# EAGLE design EquaBoardDB (EAGLE 6.5.0)
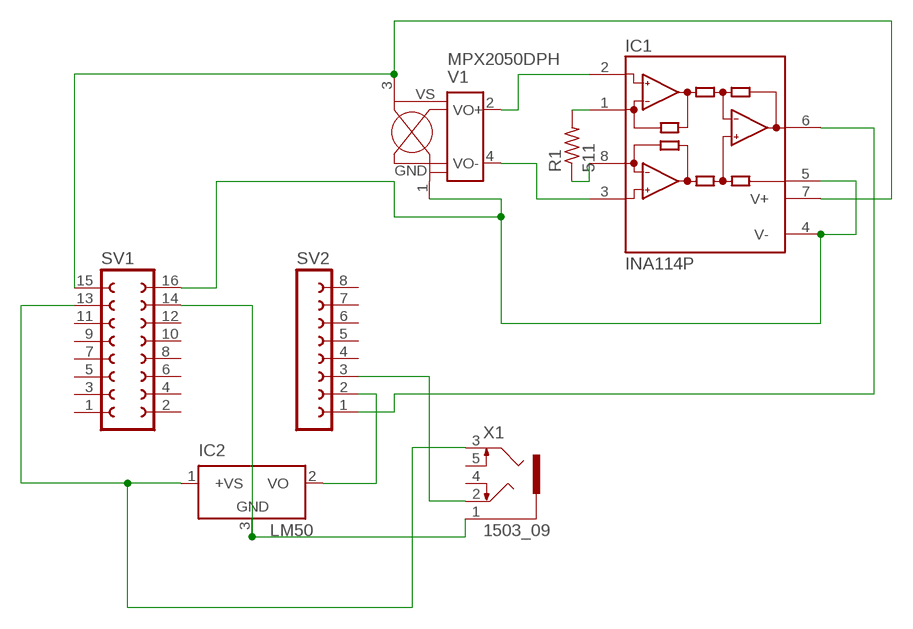
[diagram p0: schematic, sheet 1]

## Parts
IC1  INA114P  [DIL08]
IC2  LM50  [SOT23]
R1  511  R-US_0204/7  [0204/7]
SV1  FE08-2  [FE08-2]
SV2  FE08-1  [FE08]
V1  MPX2050DPH  [MPX2050DPH]
X1  1503_09  [1503_09]

## Nets
N$1: IC1.2(-IN) V1.2(VO+)
N$2: IC1.3(+IN) V1.4(VO-)
N$3: IC1.1(RG) R1.2
N$4: IC1.8(RG) R1.1
N$5: IC1.4(V-) IC1.5(REF) SV1.16 V1.1(GND)
N$6: IC1.7(V+) SV1.15 V1.3(VS)
N$8: IC1.6(OUT) SV2.1
N$9: IC2.1(+VS) SV1.13 X1.3
N$10: IC2.3(GND) SV1.14 X1.1
N$11: IC2.2(VO) SV2.2
N$13: SV2.3 X1.2
Unconnected: SV1.1 SV1.2 SV1.3 SV1.4 SV1.5 SV1.6 SV1.7 SV1.8 SV1.9 SV1.10 SV1.11 SV1.12 SV2.4 SV2.5 SV2.6 SV2.7 SV2.8 X1.4 X1.5

## Library data of the parts
IC1 = burr-brown:INA114: Precision Instrumentation Amplifier; MF: TEXAS INSTRUMENTS; MPN: INA114BP; OC_FARNELL: 1212399; OC_NEWARK: 74K3810
IC2 = linear:LM50: SOT-23 Single-Supply Centigrade Temperature Sensor Vout = (10mV/°C x Temp °C) +5mmmV Source: http://cache.national.com/ds/LM/LM50.pdf
R1 = rcl:R-US_: RESISTOR, American symbol
SV1 = con-lsta:FE08-2: FEMALE HEADER; OC_FARNELL: unknown; OC_NEWARK: unknown
SV2 = con-lsta:FE08-1: FEMALE HEADER; OC_FARNELL: unknown; OC_NEWARK: unknown
V1 = motorola-sensor-driver:MPX2050*: 50 kPa Pressure Sensor On-Chip Temparetur Compensated & Calibrated Silicon Pressure Sensor; OC_FARNELL: unknown; OC_NEWARK: unknown
X1 = con-lumberg:1503_09: Jack connectors according to JISC 6560, 3.5 mm Klinkeneinbaukupplung nach JISC 6560, 3,5 mm, 3-polig/ stereo, abgewinkelte Ausführung, mit 2 Öffnern und Lötaugen, für Leiterplatten Rückseitenmontage Source: http://www.lumberg.com/Produkte/PDFs/1503_09.pdf; OC_FARNELL: 1243244; OC_NEWARK: unknown

## Board
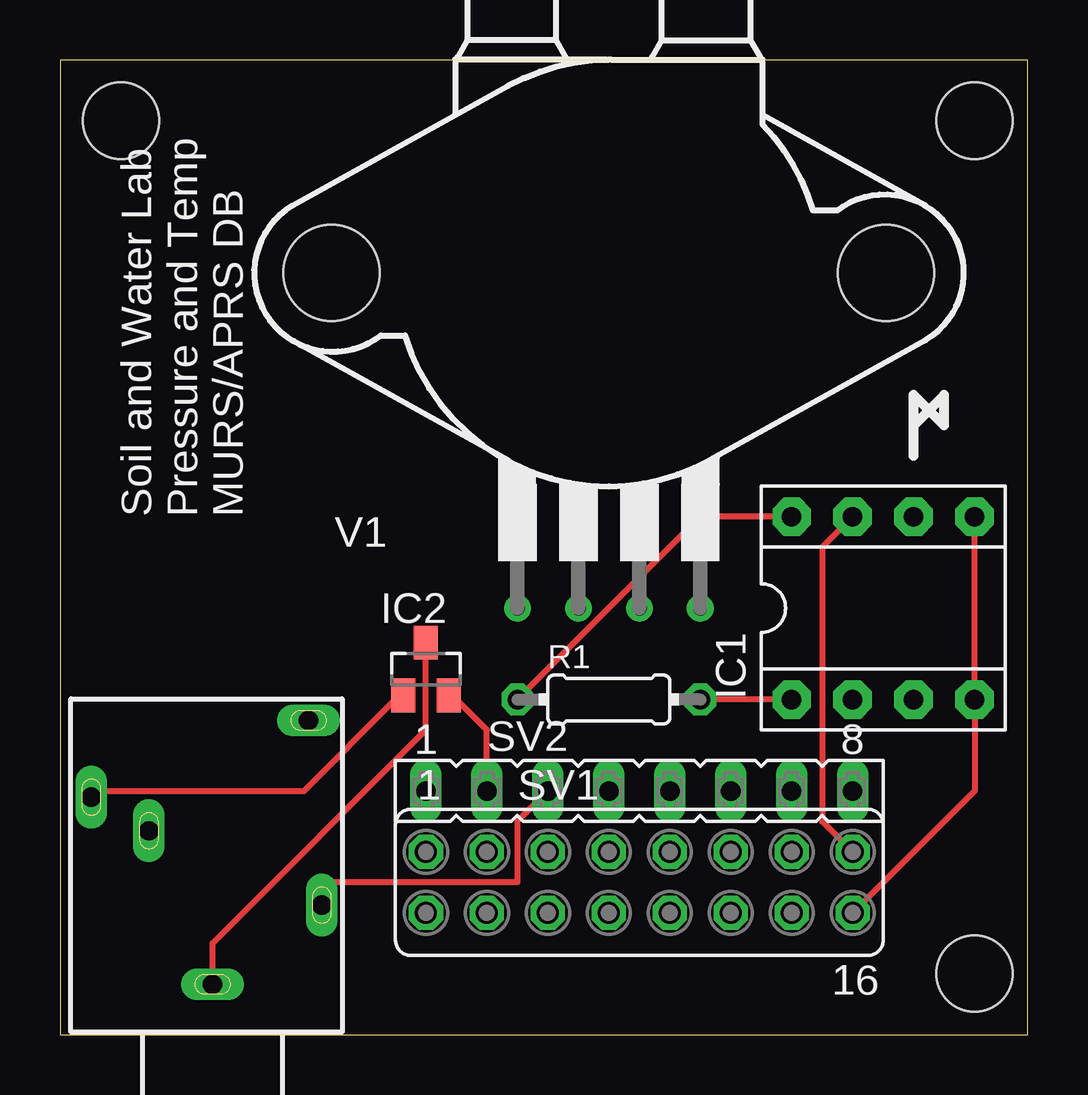
[diagram p1: board, top side]
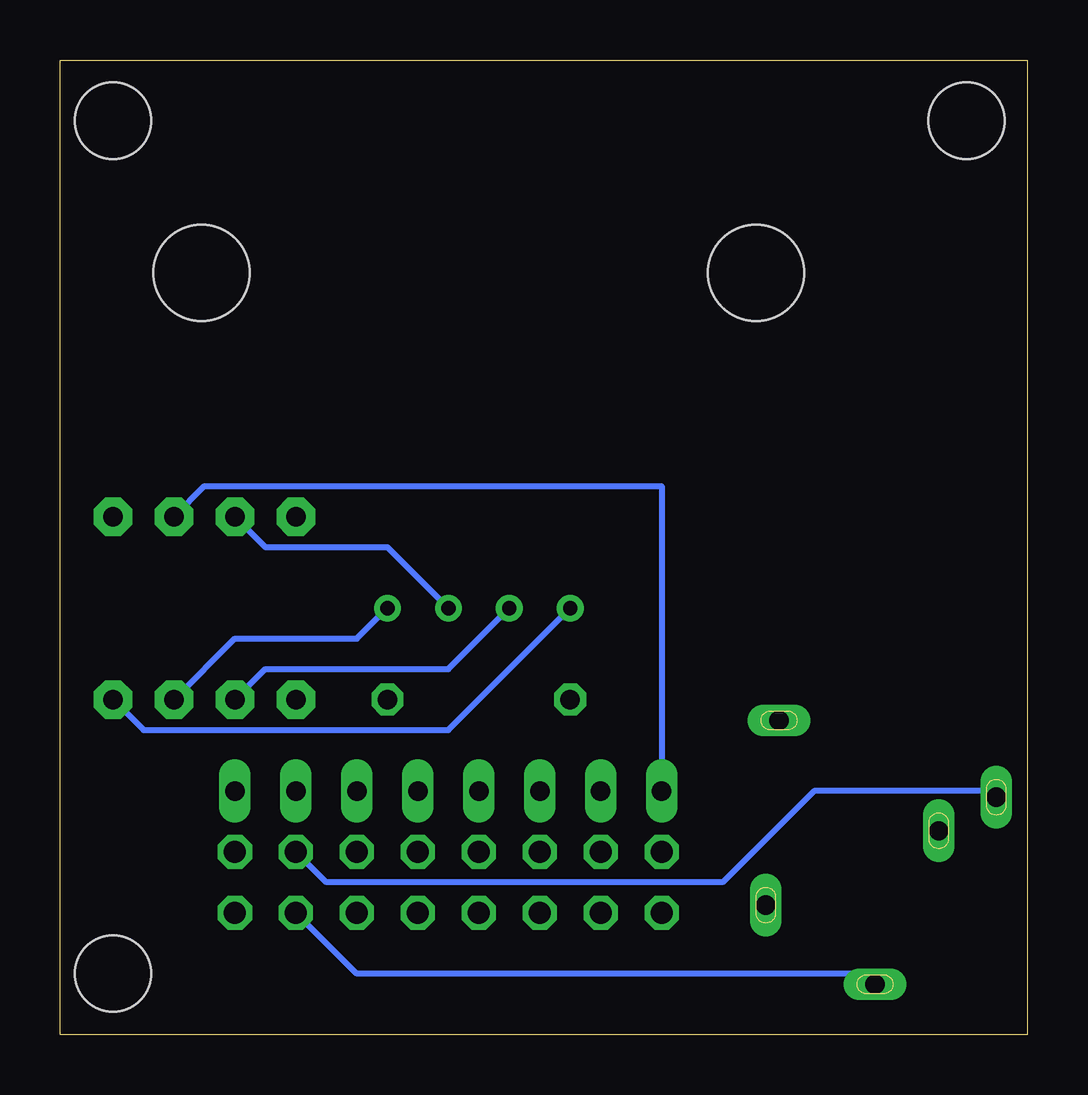
[diagram p2: board, bottom side, seen from below]

Size 40.31 x 40.63 mm. Coordinates in mm from the lower left corner, seen from the top.
Outline: 0,0 40.31,0 40.31,40.63 0,40.63 0,0
Copper layers (1*16): Top 0.035mm / dielectric 1.5mm / Bottom 0.035mm
Design rules "default": minimum track width 10mil, minimum drill 24mil, track to track 8mil, track to pad 8mil, pad to pad 8mil, via to via 8mil, smd to smd 8mil, copper to edge 40mil, drill to drill 8mil, minimum pad ring 10mil, minimum via ring 8mil, stop-mask expansion 4mil, vias tented up to drill 0mil, thermal gap 10mil
Holes 3.17 mm at 2.54,38.1 38.1,38.1 38.1,2.54

### Footprints (pad centres in the part's own frame; a part is rotated, then mirrored left to right if it is on the bottom)
DIL08 = drill 0.813 pad 1.6 octagon: 1 -3.81,-3.81; 2 -1.27,-3.81; 3 1.27,-3.81; 4 3.81,-3.81; 5 3.81,3.81; 6 1.27,3.81; 7 -1.27,3.81; 8 -3.81,3.81
SOT23 = smd 1 x 1.4: 1 -0.95,-1.1; 2 0.95,-1.1; 3 0,1.1
0204/7 = drill 0.813 octagon: 1 -3.81,0; 2 3.81,0
FE08-2 = drill 0.914 octagon: 1 -8.89,1.27; 2 -8.89,-1.27; 3 -6.35,1.27; 4 -6.35,-1.27; 5 -3.81,1.27; 6 -3.81,-1.27; 7 -1.27,1.27; 8 -1.27,-1.27; 9 1.27,1.27; 10 1.27,-1.27; 11 3.81,1.27; 12 3.81,-1.27; 13 6.35,1.27; 14 6.35,-1.27; 15 8.89,1.27; 16 8.89,-1.27
FE08 = drill 0.813 long: 1 -8.89,0; 2 -6.35,0; 3 -3.81,0; 4 -1.27,0; 5 1.27,0; 6 3.81,0; 7 6.35,0; 8 8.89,0
MPX2050DPH = drill 0.6: 1 -3.81,-13.97; 2 -1.27,-13.97; 3 1.27,-13.97; 4 3.81,-13.97 | hole 4: 11.555,0; -11.555,0
1503_09 = drill 0.8 pad 1.2 long: 1 0,-2.1; 2 -4.55,-5.4; 3 5.05,-9.9; 4 -4,-13.1; 5 2.65,-8.5

### Placement (x,y rotation side)
IC1  34.29,17.78 0 top
IC2  15.24,15.24 0 top
R1  22.86,13.97 0 top
SV1  24.13,6.35 0 top
SV2  24.13,10.16 0 top
V1  22.86,31.75 0 top
X1  6.35,0 180 top

### Tracks (layer width: path | path; a pad name or v marks a point on that pad's centre or on a via)
N$1
  Bottom 0.254: V1.2 24.13,15.24 31.75,15.24 IC1.2
N$2
  Bottom 0.254: V1.4 27.94,16.51 33.02,16.51 IC1.3
N$3
  Top 0.254: IC1.1 R1.2
N$4
  Top 0.254: R1.1 26.67,21.59 IC1.8
N$5
  Top 0.254: SV1.16 38.1,10.16 IC1.4 IC1.5
  Bottom 0.254: V1.1 24.13,12.7 36.83,12.7 IC1.4
N$6
  Top 0.254: SV1.15 31.75,8.89 31.75,20.32 IC1.7
  Bottom 0.254: V1.3 26.67,20.32 31.75,20.32 IC1.7
N$8
  Bottom 0.254: SV2.1 15.24,22.86 34.29,22.86 IC1.6
N$9
  Top 0.254: IC2.1 13.97,13.97 10.16,10.16 1.27,10.16 X1.3
  Bottom 0.254: SV1.13 29.21,6.35 12.7,6.35 8.89,10.16 1.27,10.16 X1.3
N$10
  Top 0.254: X1.1 6.35,3.81 15.24,12.7 IC2.3 15.24,16.51
  Bottom 0.254: SV1.14 27.94,2.54 6.35,2.54 X1.1
N$11
  Top 0.254: SV2.2 17.78,12.7 16.51,13.97 IC2.2
N$13
  Top 0.254: SV2.3 19.05,8.89 19.05,6.35 11.43,6.35 X1.2

### Text on the board
tPlace: Soil and Water Lab / Pressure and Temp / MURS/APRS DB